# Altium project Asfaloth_L2_AVI_ver1.1.PrjPcb
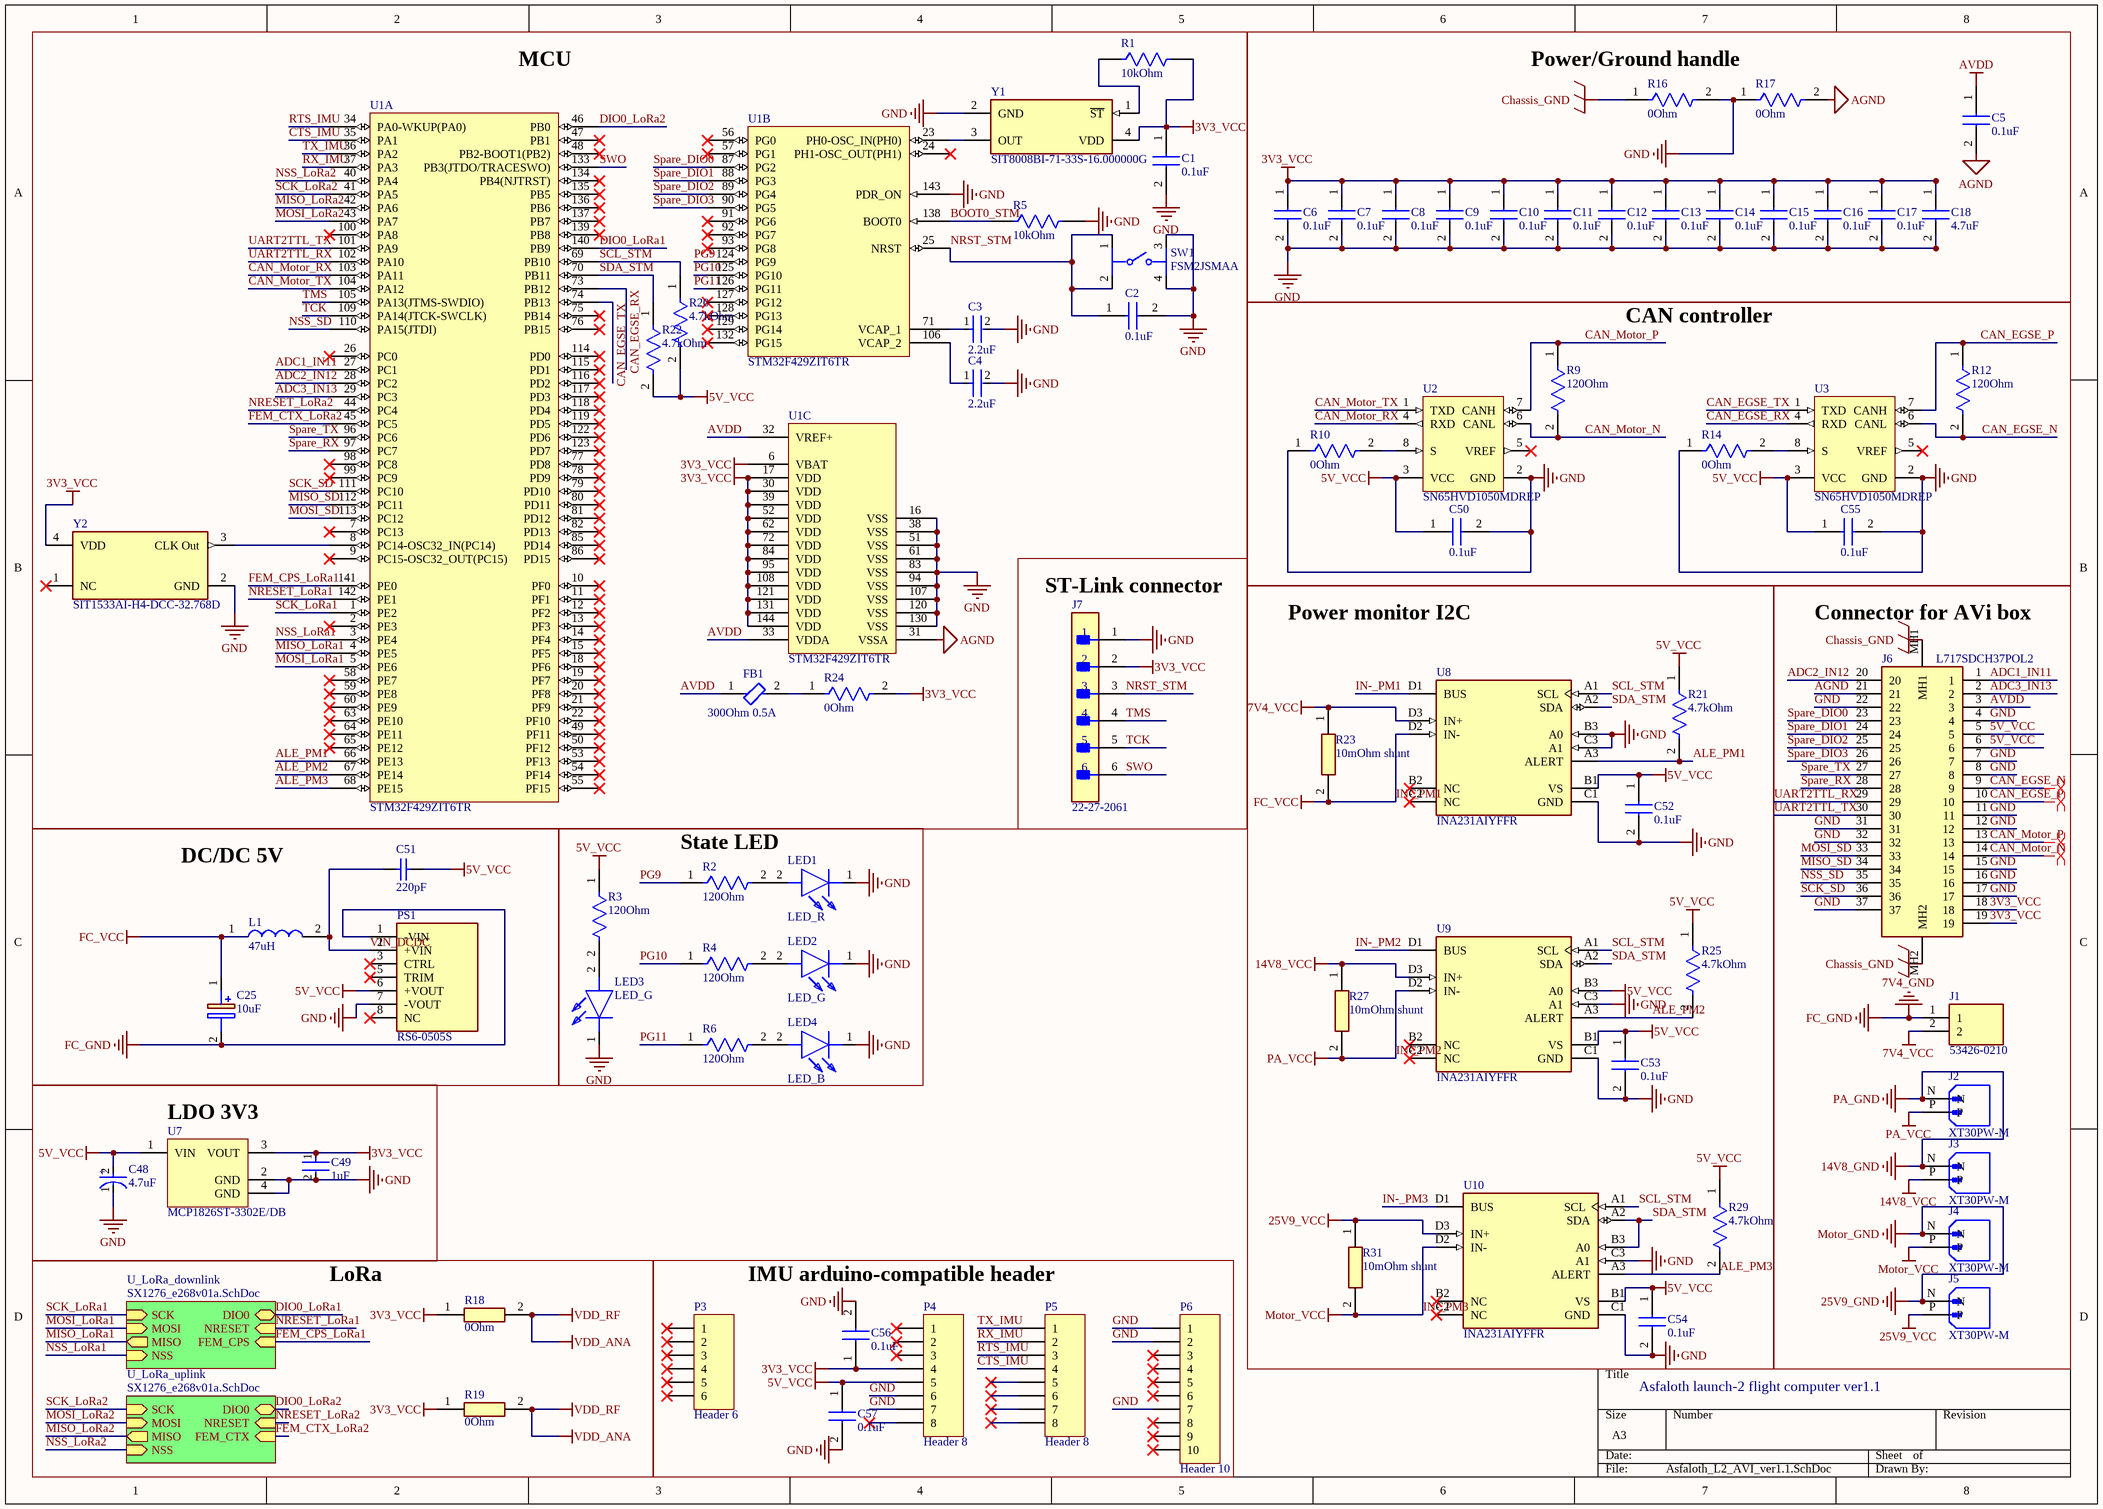
[diagram p0: Asfaloth_L2_AVI_ver1.1.SchDoc]
2 sheets, 268 parts. Net scope: hierarchical (ports join the sheet entries above them; power ports are global).
Board file: Asfaloth_L2_AVI_ver1.1.PcbDoc
Sheets:
  Asfaloth_L2_AVI_ver1.1.SchDoc
    U_LoRa_downlink = SX1276_e268v01a.SchDoc
    U_LoRa_uplink = SX1276_e268v01a.SchDoc

## Sheet Asfaloth_L2_AVI_ver1.1.SchDoc
size A3

### Parts
C1  0.1uF  [CAPC1608X87N]
C2  0.1uF  [CAPC1608X87N]
C3  2.2uF  [FP-GRT155-0_2-IPC_C]
C4  2.2uF  [FP-GRT155-0_2-IPC_C]
C5  0.1uF  [CAPC1608X87N]
C6  0.1uF  [CAPC1608X87N]
C7  0.1uF  [CAPC1608X87N]
C8  0.1uF  [CAPC1608X87N]
C9  0.1uF  [CAPC1608X87N]
C10  0.1uF  [CAPC1608X87N]
C11  0.1uF  [CAPC1608X87N]
C12  0.1uF  [CAPC1608X87N]
C13  0.1uF  [CAPC1608X87N]
C14  0.1uF  [CAPC1608X87N]
C15  0.1uF  [CAPC1608X87N]
C16  0.1uF  [CAPC1608X87N]
C17  0.1uF  [CAPC1608X87N]
C18  4.7uF  [GRT188]
C25  10uF  [CAPAE830X650N]
C48  4.7uF  [FP-TAJA-MFG]
C49  1uF  [FP-GCM21B-0_15-MFG]
C50  0.1uF  [CAPC1608X87N]
C51  220pF  [CAPC1608X87X35LL15T15]
C52  0.1uF  [CAPC1608X87N]
C53  0.1uF  [CAPC1608X87N]
C54  0.1uF  [CAPC1608X87N]
C55  0.1uF  [CAPC1608X87N]
C56  0.1uF  [CAPC1608X87N]
C57  0.1uF  [CAPC1608X87N]
FB1  300Ohm 0.5A  [FP-MMZ1608-0_8-MFG]
J1  53426-0210  [534260210]
J2  XT30PW-M  [AMASS_XT30PW-M]
J3  XT30PW-M  [AMASS_XT30PW-M]
J4  XT30PW-M  [AMASS_XT30PW-M]
J5  XT30PW-M  [AMASS_XT30PW-M]
J6  L717SDCH37POL2  [L717SDCH37POL2]
J7  22-27-2061  [FP-22-27-2061-MFG]
L1  47uH  [SRR5228A]
LED1  LED_R  [LEDC2012X80N]
LED2  LED_G  [LEDC2012X90N]
LED3  LED_G  [LEDC2012X90N]
LED4  LED_B  [LEDM2012X100N]
P3  Header 6  [HDR1X6]
P4  Header 8  [HDR1X8]
P5  Header 8  [HDR1X8]
P6  Header 10  [HDR1X10]
PS1  RS6-0505S  [RS60505S]
R1  10kOhm  [FP-CRCW0805-e3-IPC_A]
R2  120Ohm  [FP-ERJ2RK-MFG]
R3  120Ohm  [FP-ERJ2RK-MFG]
R4  120Ohm  [FP-ERJ2RK-MFG]
R5  10kOhm  [FP-CRCW0805-e3-IPC_A]
R6  120Ohm  [FP-ERJ2RK-MFG]
R9  120Ohm  [FP-ERJ2RK-MFG]
R10  0Ohm  [FP-AC0603-0_55-IPC_A]
R12  120Ohm  [FP-ERJ2RK-MFG]
R14  0Ohm  [FP-AC0603-0_55-IPC_A]
R16  0Ohm  [FP-AC0603-0_55-IPC_A]
R17  0Ohm  [FP-AC0603-0_55-IPC_A]
R18  0Ohm  [RESC3216X60N]
R19  0Ohm  [RESC3216X60N]
R20  4.7kOhm  [FP-KTR03-IPC_C]
R21  4.7kOhm  [FP-KTR03-IPC_C]
R22  4.7kOhm  [FP-KTR03-IPC_C]
R23  10mOhm shunt  [CSS0805FT10L0]
R24  0Ohm  [FP-AC0603-0_55-IPC_A]
R25  4.7kOhm  [FP-KTR03-IPC_C]
R27  10mOhm shunt  [CSS0805FT10L0]
R29  4.7kOhm  [FP-KTR03-IPC_C]
R31  10mOhm shunt  [CSS0805FT10L0]
SW1  FSM2JSMAA  [FP-FSM2JSMAA-MFG]
U1  STM32F429ZIT6TR  [STM-LQFP144_M]  (parts A,B,C of 3)
U2  SN65HVD1050MDREP  [D0008A_M]
U3  SN65HVD1050MDREP  [D0008A_M]
U7  MCP1826ST-3302E/DB  [SOT-223-DB3_L]
U8  INA231AIYFFR  [FP-YFF0012-IPC_C]
U9  INA231AIYFFR  [FP-YFF0012-IPC_C]
U10  INA231AIYFFR  [FP-YFF0012-IPC_C]
Y1  SIT8008BI-71-33S-16.000000G  [FP-SiT8008-7-MFG]
Y2  SIT1533AI-H4-DCC-32.768D  [FP-SiT1533-H-MFG]

### Blocks framed on the sheet
MCU: C1-C4 FB1 R1 R5 R20 R22 R24 SW1 U1 Y1 Y2
Power/Ground handle: C5-C18 R16 R17
CAN controller: C50 C55 R9 R10 R12 R14 U2 U3
ST-Link connector: J7
Power monitor I2C: C52-C54 R21 R23 R25 R27 R29 R31 U8-U10
Connector for AVi box: J1-J6
DC/DC 5V: C25 C51 L1 PS1
State LED: LED1-LED4 R2-R4 R6
LDO 3V3: C48 C49 U7
LoRa: R18 R19
IMU arduino-compatible header: C56 C57 P3-P6

### Sub-sheets
U_LoRa_downlink = SX1276_e268v01a.SchDoc: SCK (in), MOSI (in), MISO (out), NSS (in), DIO0 (bidir), NRESET (in), FEM_CPS (in)
U_LoRa_uplink = SX1276_e268v01a.SchDoc: SCK (in), MOSI (in), MISO (out), NSS (in), DIO0 (bidir), NRESET (in), FEM_CTX (in)

### Nets
3V3_VCC: C1.1 C6.1 C7.1 C8.1 C9.1 C10.1 C11.1 C12.1 C13.1 C14.1 C15.1 C16.1 C17.1 C18.1 C49.1 C56.1 J6.18 J6.19 J7.2 P4.4 R1.2 R18.1 R19.1 R24.2 U1.6(VBAT) U1.17(VDD) U1.30(VDD) U1.39(VDD) U1.52(VDD) U1.62(VDD) U1.72(VDD) U1.84(VDD) U1.95(VDD) U1.108(VDD) U1.121(VDD) U1.131(VDD) U1.144(VDD) U7.3(VOUT) Y1.4(VDD) Y2.4(VDD)
5V_VCC: C48.2(A) C50.1 C51.2 C52.1 C53.1 C54.1 C55.1 C57.1 J6.5 J6.6 P4.5 PS1.6(+VOUT) R3.1 R20.2 R21.1 R22.2 R25.1 R29.1 U2.3(VCC) U3.3(VCC) U7.1(VIN) U8.B1(VS) U9.B1(VS) U9.B3(A0) U10.B1(VS)
7V4_GND: C25.2(-) J1.1 PS1.1(-VIN)  [also labelled FC_GND]
7V4_VCC: J1.2 R23.1 U8.D3(IN+)
14V8_GND: J2.N J3.N  [also labelled PA_GND]
14V8_VCC: J3.P R27.1 U9.D3(IN+)
25V9_GND: J4.N J5.N  [also labelled Motor_GND]
25V9_VCC: J5.P R31.1 U10.D3(IN+)
AGND: C5.2 J6.21 R17.2 U1.31(VSSA)
AVDD: C5.1 FB1.1 J6.3 U1.32(VREF+) U1.33(VDDA)
Chassis_GND: J6.MH1 J6.MH2 R16.1
GND: C1.2 C2.2 C3.2 C4.2 C6.2 C7.2 C8.2 C9.2 C10.2 C11.2 C12.2 C13.2 C14.2 C15.2 C16.2 C17.2 C18.2 C48.1(C) C49.2 C50.2 C52.2 C53.2 C54.2 C55.2 C56.2 C57.2 J6.4 J6.7 J6.8 J6.11 J6.12 J6.15 J6.16 J6.17 J6.22 J6.31 J6.32 J6.37 J7.1 LED1.1(K) LED2.1(K) LED3.1(K) LED4.1(K) P4.6 P4.7 P6.1 P6.2 P6.7 PS1.7(-VOUT) R5.2 R10.1 R14.1 R16.2 R17.1 SW1.3 SW1.4 U1.16(VSS) U1.38(VSS) U1.51(VSS) U1.61(VSS) U1.83(VSS) U1.94(VSS) U1.107(VSS) U1.120(VSS) U1.130(VSS) U1.143(PDR_ON) U2.2(GND) U3.2(GND) U7.2(GND) U7.4(GND) U8.B3(A0) U8.C1(GND) U8.C3(A1) U9.C1(GND) U9.C3(A1) U10.C1(GND) U10.C3(A1) Y1.2(GND) Y2.2(GND)
IN-_PM1: C25.1(+) L1.1 R23.2 U8.D1(BUS) U8.D2(IN-)  [also labelled FC_VCC]
IN-_PM2: J2.P R27.2 U9.D1(BUS) U9.D2(IN-)  [also labelled PA_VCC]
IN-_PM3: J4.P R31.2 U10.D1(BUS) U10.D2(IN-)  [also labelled Motor_VCC]
VDD_ANA: R18.2 R19.2  [also labelled VDD_RF]
ADC1_IN11: J6.1 U1.27(PC1)
ADC2_IN12: J6.20 U1.28(PC2)
ADC3_IN13: J6.2 U1.29(PC3)
ALE_PM1: R21.2 U1.66(PE13) U8.A3(ALERT)
ALE_PM2: R25.2 U1.67(PE14) U9.A3(ALERT)
ALE_PM3: R29.2 U1.68(PE15) U10.A3(ALERT)
BOOT0_STM: R5.1 U1.138(BOOT0)
CAN_EGSE_N: J6.9 R12.2 U3.6(CANL)
CAN_EGSE_P: J6.10 R12.1 U3.7(CANH)
CAN_EGSE_RX: U1.73(PB12) U3.4(RXD)
CAN_EGSE_TX: U1.74(PB13) U3.1(TXD)
CAN_Motor_N: J6.14 R9.2 U2.6(CANL)
CAN_Motor_P: J6.13 R9.1 U2.7(CANH)
CAN_Motor_RX: U1.103(PA11) U2.4(RXD)
CAN_Motor_TX: U1.104(PA12) U2.1(TXD)
CTS_IMU: P5.4 U1.35(PA1)
DIO0_LoRa1: U1.140(PB9) ; sheet U_LoRa_downlink/DIO0  [project net DIO0]
DIO0_LoRa2: U1.46(PB0) ; sheet U_LoRa_uplink/DIO0  [project net DIO0]
FEM_CPS_LoRa1: U1.141(PE0) ; sheet U_LoRa_downlink/FEM_CPS  [project net FEM_CPS]
FEM_CTX_LoRa2: U1.45(PC5) ; sheet U_LoRa_uplink/FEM_CTX  [project net FEM_CTX]
MISO_LoRa1: U1.4(PE5) ; sheet U_LoRa_downlink/MISO  [project net MISO]
MISO_LoRa2: U1.42(PA6) ; sheet U_LoRa_uplink/MISO  [project net MISO]
MISO_SD: J6.34 U1.112(PC11)
MOSI_LoRa1: U1.5(PE6) ; sheet U_LoRa_downlink/MOSI  [project net MOSI]
MOSI_LoRa2: U1.43(PA7) ; sheet U_LoRa_uplink/MOSI  [project net MOSI]
MOSI_SD: J6.33 U1.113(PC12)
NRESET_LoRa1: U1.142(PE1) ; sheet U_LoRa_downlink/NRESET  [project net NRESET]
NRESET_LoRa2: U1.44(PC4) ; sheet U_LoRa_uplink/NRESET  [project net NRESET]
NRST_STM: C2.1 J7.3 SW1.1 SW1.2 U1.25(NRST)
NSS_LoRa1: U1.3(PE4) ; sheet U_LoRa_downlink/NSS  [project net NSS]
NSS_LoRa2: U1.40(PA4) ; sheet U_LoRa_uplink/NSS  [project net NSS]
NSS_SD: J6.35 U1.110(PA15(JTDI))
PG9: R2.1 U1.124(PG9)
PG10: R4.1 U1.125(PG10)
PG11: R6.1 U1.126(PG11)
RTS_IMU: P5.3 U1.34(PA0-WKUP(PA0))
RX_IMU: P5.2 U1.37(PA3)
SCK_LoRa1: U1.1(PE2) ; sheet U_LoRa_downlink/SCK  [project net SCK]
SCK_LoRa2: U1.41(PA5) ; sheet U_LoRa_uplink/SCK  [project net SCK]
SCK_SD: J6.36 U1.111(PC10)
SCL_STM: R20.1 U1.69(PB10) U8.A1(SCL) U9.A1(SCL) U10.A1(SCL)
SDA_STM: R22.1 U1.70(PB11) U8.A2(SDA) U9.A2(SDA) U10.A2(SDA) U10.B3(A0)
Spare_DIO0: J6.23 U1.87(PG2)
Spare_DIO1: J6.24 U1.88(PG3)
Spare_DIO2: J6.25 U1.89(PG4)
Spare_DIO3: J6.26 U1.90(PG5)
Spare_RX: J6.28 U1.97(PC7)
Spare_TX: J6.27 U1.96(PC6)
SWO: J7.6 U1.133(PB3(JTDO/TRACESWO))
TCK: J7.5 U1.109(PA14(JTCK-SWCLK))
TMS: J7.4 U1.105(PA13(JTMS-SWDIO))
TX_IMU: P5.1 U1.36(PA2)
UART2TTL_RX: J6.29 U1.102(PA10)
UART2TTL_TX: J6.30 U1.101(PA9)
VIN_DCDC: C51.1 L1.2 PS1.2(+VIN)
NetC3_1: C3.1 U1.71(VCAP_1)
NetC4_1: C4.1 U1.106(VCAP_2)
NetFB1_2: FB1.2 R24.1
NetLED1_2: LED1.2(A) R2.2
NetLED2_2: LED2.2(A) R4.2
NetLED3_2: LED3.2(A) R3.2
NetLED4_2: LED4.2(A) R6.2
NetR1_1: R1.1 Y1.1(~{ST})
NetR10_2: R10.2 U2.8(S)
NetR14_2: R14.2 U3.8(S)
NetU1_8: U1.8(PC14-OSC32_IN(PC14)) Y2.3(CLK_Out)
NetU1_23: U1.23(PH0-OSC_IN(PH0)) Y1.3(OUT)

Not connected (* = marked no-connect by the designer): P3 1* 2* 3* 4* 5* 6*; P4 1* 2* 3* 8*; P5 5* 6* 7* 8*; P6 3* 4* 5* 6* 8* 9* 10*; PS1 3(CTRL)* 5(TRIM)* 8(NC)*; U1 2(PE3)* 7(PC13)* 9(PC15-OSC32_OUT(PC15))* 10(PF0)* 11(PF1)* 12(PF2)* 13(PF3)* 14(PF4)* 15(PF5)* 18(PF6)* 19(PF7)* 20(PF8)* 21(PF9)* 22(PF10)* 24(PH1-OSC_OUT(PH1))* 26(PC0)* 47(PB1)* 48(PB2-BOOT1(PB2))* 49(PF11)* 50(PF12)* 53(PF13)* 54(PF14)* 55(PF15)* 56(PG0)* 57(PG1)* 58(PE7)* 59(PE8)* 60(PE9)* 63(PE10)* 64(PE11)* 65(PE12)* 75(PB14)* 76(PB15)* 77(PD8)* 78(PD9)* 79(PD10)* 80(PD11)* 81(PD12)* 82(PD13)* 85(PD14)* 86(PD15)* 91(PG6)* 92(PG7)* 93(PG8)* 98(PC8)* 99(PC9)* 100(PA8)* 114(PD0)* 115(PD1)* 116(PD2)* 117(PD3)* 118(PD4)* 119(PD5)* 122(PD6)* 123(PD7)* 127(PG12)* 128(PG13)* 129(PG14)* 132(PG15)* 134(PB4(NJTRST))* 135(PB5)* 136(PB6)* 137(PB7)* 139(PB8)*; U2 5(VREF)*; U3 5(VREF)*; U8 B2(NC)* C2(NC)*; U9 B2(NC)* C2(NC)*; U10 B2(NC)* C2(NC)*; Y2 1(NC)*

### Layout directives
differential pair: CAN_EGSE_N, CAN_EGSE_P, CAN_Motor_N, CAN_Motor_P

### Notes on the sheet
- Asfaloth launch-2 flight computer ver1.1
- (in symbol CMP-2100-03687-2) +

### Library data of the parts
C1 C2 C5-C17 C50 C52-C57 = C0603C104J4RECAUTO: Capacitor; Manufacturer_Name: KEMET; Datasheet Link: https://content.kemet.com/datasheets/KEM_C1090_X7R_ESD.pdf; Height: 0.87mm; Manufacturer_Part_Number: C0603C104J4RECAUTO; Mouser Part Number: 80-C0603C104J4RECAUT; Mouser Price/Stock: https://www.mouser.co.uk/ProductDetail/KEMET/C0603C104J4RECAUTO?qs=MLItCLRbWswpTgrKtA5UXg%3D%3D
C3 C4 = CMP-06035-008228-1: Multi-Layer Ceramic Capacitor 2.2uF 10V X6S ±10% 0402 Paper T/R; Case Code (Imperial): 0402; Max Operating Temperature: 105°C; Width: 0.02inch; Thickness: 0.022inch; Ratings: AEC-Q200; Mount: Surface Mount; Voltage Rating (DC): 10V; Capacitance: 2.2uF; Voltage Rating: 10V; Dielectric: X6S; Packaging: Tape and Reel; Case/Package: 0402; Case Code (Metric): 1005; Tolerance: 10%; Min Operating Temperature: -55°C; Length: 0.039inch
C18 = GRT188C71C475KE13D: Capacitor; Manufacturer_Name: Murata Electronics; Datasheet Link: https://www.murata.com/en-global/products/productdetail?partno=GRT188C71C475KE13%23; Height: 0.8mm; Manufacturer_Part_Number: GRT188C71C475KE13D; Mouser Part Number: 81-GRT188C71C475KE13; Mouser Price/Stock: https://www.mouser.co.uk/ProductDetail/Murata-Electronics/GRT188C71C475KE13D?qs=pUKx8fyJudC7lYX%252BQNKS7Q%3D%3D; Arrow Part Number: GRT188C71C475KE13D; Arrow Price/Stock: https://www.arrow.com/en/products/grt188c71c475ke13d/murata-manufacturing?region=nac
C25 = EEE-TG1J100P: Capacitor Polarised; Manufacturer_Name: Panasonic; Datasheet Link: http://industrial.panasonic.com/cdbs/www-data/pdf/RDE0000/ABA0000C1187.pdf; Height: 6.5mm; Manufacturer_Part_Number: EEE-TG1J100P; Mouser Part Number: 667-EEE-TG1J100P; Mouser Price/Stock: https://www.mouser.co.uk/ProductDetail/Panasonic/EEE-TG1J100P?qs=aAAGLDy8P2x3htHP%2FTxLDQ%3D%3D; Arrow Part Number: EEE-TG1J100P; Arrow Price/Stock: https://www.arrow.com/en/products/eee-tg1j100p/panasonic; Supplier 1: Mouser; Supplier Part Number 1: 667-EEE-TG1J100P
C48 = CMP-2100-03687-2: 4.7uF 16V  ±10% 4Ω 1206  SMD Tantalum Capacitor; Leakage Current: 800nA; ESR (Equivalent Series Resistance): 4R; Dissipation Factor: 6%; Polarity: Polar; Number of Pins: 2; Case Code (Metric): 3216; Dielectric Material: Tantalum; REACH SVHC: No SVHC; Height: 1.6mm; Lead Pitch: 1.1mm; Tolerance: 10%; Voltage Rating (DC): 16V; Features: General Purpose; Case Code (Imperial): 1206; Packaging: Tape and Reel; Termination: SMD/SMT; Capacitance: 4.7uF; Voltage: 16V; Case/Package: 1206; Length: 3.2mm; Max Operating Temperature: 125°C; Depth: 1.6mm; Height - Seated (Max): 0.071inch; Series: TAJ; Mount: Surface Mount; Package Quantity: 1; Radiation Hardening: No; Voltage Rating: 16V; Min Operating Temperature: -55°C; Lead Free: Lead Free; RoHS Compliant: Yes; Width: 1.6mm; Construction: Flat
C49 = CMP-06035-047787-1: Ceramic Capacitor for Automotive 1uF ±10% 16VDC X7R 0805 Embossed T/R; Voltage Rating (DC): 16V; Capacitance: 1uF; Case/Package: 0805; Dielectric: X7R; Depth: 1.25mm; Min Operating Temperature: -55°C; Max Operating Temperature: 125°C; Packaging: Tape and Reel; Length: 2mm; Tolerance: 10%
C51 = CMP-2006-03337-1: Part Number: C0603C221J5GACAUTO; Manufacturer: Kemet
FB1 = CMP-08257-000454-1: Signal Line Ferrite Bead 300Ω  @ 100MHz 500mA DCR 300mΩ SMD 0603; Impedance: 300R; Tolerance: 25%; DC Resistance (DCR): 300mR; Case Code (Metric): 1608; Core Material: Ferrite; Package Quantity: 4000; Depth: 0.8mm; RoHS Compliant: Yes; Series: MMZ; Case Code (Imperial): 0603; Mount: Surface Mount; Length: 0.063inch; Case/Package: 0603; Width: 0.031inch; Height: 0.037inch; Lead Free: Lead Free; Max DC Current: 500mA; Packaging: Tape and Reel; Current Rating: 500mA
J1 = 53426-0210: Headers & Wire Housings 2.50MM 2P RA HDR FRCTN POS LOCK; Manufacturer_Name: Molex; Geometry.Height: 6.9mm; Mouser Part Number: 538-53426-0210; Mouser Price/Stock: https://www.mouser.co.uk/ProductDetail/Molex/53426-0210?qs=9BfFgGvh7CeGd9pd%252BU8okg%3D%3D; Manufacturer_Part_Number: 53426-0210; Datasheet Link: https://www.molex.com/pdm_docs/sd/534260210_sd.pdf
J2-J5 = XT30PW-M: Socket; DC supply; XT30; male; PIN: 2; on PCBs; THT; Colour: yellow; MF: AMASS; SnapEDA_Link: https://www.snapeda.com/parts/XT30PW-M/AMASS/view-part/?ref=snap; Package: None; Value: *; MP: XT30PW-M; Check_prices: https://www.snapeda.com/parts/XT30PW-M/AMASS/view-part/?ref=eda
J6 = L717SDCH37POL2: Dsub, Stamped Signal 3A, Straight PCB Thru Hole, 37 Pin, Flash Gold, Bright Tin Shell+Grounding Dimples, 4-40 Rear Nut Height 5.9mm; Manufacturer_Name: Amphenol Communications Solutions; Geometry.Height: 12.5mm; Mouser Part Number: *; Mouser Price/Stock: *; Manufacturer_Part_Number: L717SDCH37POL2; Datasheet Link: https://cdn.amphenol-cs.com/media/wysiwyg/files/drawing/l717sdxhxxpol2.pdf
J7 = CMP-04776-000309-1: CONN HEADER VERT 6POS 2.54MM; Number of Contacts: 6; Current Rating: 4A; Voltage Rating (AC): 250V; Contact Resistance: 10mR; Hole Diameter: 1.02mm; Connector Type: Male Pin; Gender: Male; Mount: Through Hole; REACH SVHC: No SVHC; Number of Rows: 1; Contact Plating: Tin; Series: KK; Depth: 5.8mm; Flammability Rating: UL94 V-0; Contact Type: Male Pin; Lead Pitch: 2.54mm; Min Operating Temperature: 0°C; Pitch: 2.54mm; Radiation Hardening: No; Color: Natural; Length: 15.24mm; Termination: Solder; Orientation: Straight; Contact Material: Brass; Max Voltage Rating (AC): 250V; Housing Material: Nylon; Max Operating Temperature: 75°C; Working Voltage: 250V; Max Current Rating: 4A; Fastening Type: Friction; Voltage Rating: 250V; Housing Color: White; Packaging: Bulk; Material: Nylon; Contact Mating Length: 0.295inch; Package Quantity: 10000; Number of Positions: 6
L1 = SRR5228A-470M: Inductor; Manufacturer_Name: Bourns; Datasheet Link: https://www.bourns.com/docs/Product-Datasheets/SRR5228A.pdf; Manufacturer_Part_Number: SRR5228A-470M; Mouser Part Number: 6521-SRR5228A-470M; Mouser Price/Stock: https://www.mouser.co.uk/ProductDetail/Bourns/SRR5228A-470M?qs=QpmGXVUTftG9kA8o879uEQ%3D%3D; Supplier 1: Mouser; Supplier Part Number 1: 6521-SRR5228A-470M
LED1 = SML-H12V8TT86C: LED; Manufacturer_Name: ROHM Semiconductor; Datasheet Link: https://www.mouser.in/ProductDetail/ROHM-Semiconductor/SML-H12V8TT86C?qs=HXFqYaX1Q2xM3o6aiCqz5g%3D%3D; Height: 0.8mm; Manufacturer_Part_Number: SML-H12V8TT86C; Mouser Part Number: 755-SML-H12V8TT86C; Mouser Price/Stock: https://www.mouser.co.uk/ProductDetail/ROHM-Semiconductor/SML-H12V8TT86C?qs=HXFqYaX1Q2xM3o6aiCqz5g%3D%3D
LED2 LED3 = SML-H12P8TT86C: LED; Manufacturer_Name: ROHM Semiconductor; Datasheet Link: https://mouser.componentsearchengine.com/Datasheets/2/SML-H12P8TT86C.pdf; Height: 0.9mm; Manufacturer_Part_Number: SML-H12P8TT86C; Mouser Part Number: 755-SML-H12P8TT86C; Mouser Price/Stock: https://www.mouser.co.uk/ProductDetail/ROHM-Semiconductor/SML-H12P8TT86C?qs=HXFqYaX1Q2xINkpk%2F8IQZg%3D%3D
LED4 = SMLMN2BCTT86C: LED; Manufacturer_Name: ROHM Semiconductor; Datasheet Link: https://fscdn.rohm.com/en/products/databook/datasheet/opto/led/chip_mono/smlmn2bctt86(c)-e.pdf; Height: 1mm; Manufacturer_Part_Number: SMLMN2BCTT86C; Mouser Part Number: 755-SMLMN2BCTT86C; Mouser Price/Stock: https://www.mouser.co.uk/ProductDetail/ROHM-Semiconductor/SMLMN2BCTT86C?qs=EAJhGnHnT02MwYNfU4gt9w%3D%3D; Arrow Part Number: SMLMN2BCTT86C; Arrow Price/Stock: https://www.arrow.com/en/products/smlmn2bctt86c/rohm-semiconductor
P3 = Header 6: Header, 6-Pin; LatestRevisionDate: 17-Jul-2002; LatestRevisionNote: Re-released for DXP Platform.; Publisher: Altium Limited
P4 P5 = Header 8: Header, 8-Pin; LatestRevisionDate: 17-Jul-2002; LatestRevisionNote: Re-released for DXP Platform.; Publisher: Altium Limited
P6 = Header 10: Header, 10-Pin; LatestRevisionDate: 17-Jul-2002; LatestRevisionNote: Re-released for DXP Platform.; Publisher: Altium Limited
PS1 = RS6-0505S: Power Supply; Manufacturer_Name: RECOM Power; Datasheet Link: https://www.recom-power.com/pdf/Econoline/RS6.pdf; Height: 11.6mm; Manufacturer_Part_Number: RS6-0505S; Mouser Part Number: 919-RS6-0505S; Mouser Price/Stock: https://www.mouser.co.uk/ProductDetail/RECOM-Power/RS6-0505S?qs=FLBwGrBR9%252B3r5kgbzQWtZg%3D%3D; Arrow Part Number: RS6-0505S; Arrow Price/Stock: https://www.arrow.com/en/products/rs6-0505s/recom-power?region=nac; Supplier 1: Mouser; Supplier Part Number 1: 919-RS6-0505S
R1 R5 = CMP-2001-04908-2: RES Thick Film, 10kΩ, 1%, 0.125W, 100ppm/°C, 0805; Resistance: 10kR; Voltage Rating (DC): 150V; Power Rating: 125mW; Weight: 0.000194oz; Package Quantity: 5000; Military Standard: Not; Max Operating Temperature: 155°C; Temperature Coefficient: 100ppm/°C; Contact Plating: Tin; Width: 1.25mm; Height: 0.45mm; Radiation Hardening: No; Tolerance: 1%; Min Operating Temperature: -55°C; Voltage Rating: 150V; Length: 2mm; Depth: 1.25mm; Termination: SMD/SMT; Packaging: Tape and Reel; Case/Package: 0805; Case Code (Metric): 2012; Lead Free: Lead Free; Case Code (Imperial): 0805; Composition: Thick Film
R2-R4 R6 R9 R12 = CMP-2002-00645-2: RES SMD 120 OHM 1% 1/10W 0402; Resistance: 120R; Voltage Rating (DC): 50V; Temperature Coefficient: 100ppm/°C; Power Rating: 100mW; Case Code (Imperial): 0402; Military Standard: Not; Width: 0.5mm; Technology: THICK FILM; Case Code (Metric): 1005; Lead Free: Lead Free; Radiation Hardening: No; Termination: SMD/SMT; Weight: 0.000388oz; Case/Package: 0402; Resistor Type: Thick Film; Number of Pins: 2; Package Quantity: 10000; Tolerance: 1%; Depth: 0.5mm; RoHS Compliant: Yes; Min Operating Temperature: -55°C; Max Operating Temperature: 155°C; Length: 1mm; Series: ERJ-2Rx; Height: 0.35mm; Mount: Surface Mount; Number of Terminations: 2; Features: Automotive AEC-Q200; Contact Plating: Tin; Voltage Rating: 50V; Max Power Dissipation: 100mW; Packaging: Cut Tape; REACH SVHC: No SVHC
R10 R14 R16 R17 R24 = CMP-2000-04815-2: RES SMD 0 OHM JUMPER 1/10W 0603; Power Rating: 100mW; Tolerance: 1%; Voltage Rating: 50V; Resistance: 0R; Temperature Coefficient: 200ppm/°C; Min Operating Temperature: -55°C; Case Code (Imperial): 0603; Size Code: 0603; Termination: SMD/SMT; Lead Free: Lead Free; Package Quantity: 1; Max Power Dissipation: 100mW; Packaging: Tape and Reel; Series: AC; Case Code (Metric): 1608; Height: 0.022inch; Length: 0.063inch; Case/Package: 0603; Resistor Type: Thick Film; Max Operating Temperature: 155°C; Features: Moisture Resistant; Width: 0.031inch; Number of Terminations: 2
R18 R19 = RCA12060000ZSEA: Resistor; Manufacturer_Name: Vishay; Datasheet Link: https://www.mouser.in/datasheet/2/427/rcae3-1761931.pdf; Height: 0.6mm; Manufacturer_Part_Number: RCA12060000ZSEA; Mouser Part Number: 71-RCA12060000ZSEA; Mouser Price/Stock: https://www.mouser.co.uk/ProductDetail/Vishay-Draloric/RCA12060000ZSEA?qs=4%252Ber4tcBTOgzMfDdqtZgmA%3D%3D; Arrow Part Number: RCA12060000ZSEA; Arrow Price/Stock: https://www.arrow.com/en/products/rca12060000zsea/vishay?region=nac
R20-R22 R25 R29 = CMP-08839-030274-1: Res Thick Film 0603 4.7kΩ 5% 0.1W ±200ppm/°C Automotive Paper T/R; Max Power Dissipation: 100mW; Resistance: 4.7kR; Width: 0.031inch; Series: KTR03; Number of Terminations: 2; RoHS Compliant: Yes; Package Quantity: 5000; Min Operating Temperature: -55°C; Height: 0.022inch; Length: 0.063inch; Resistor Type: Thick Film; Tolerance: 5%; Case/Package: 0603; Temperature Coefficient: 200ppm/°C; Max Operating Temperature: 155°C; Packaging: Tape and Reel
R23 R27 R31 = CSS0805FT10L0: Resistor; Manufacturer_Name: Stackpole Electronics; Datasheet Link: https://cs.seielect.com/catalog/SEI-CSS_CSSH.PDF; Height: 0.65mm; Manufacturer_Part_Number: CSS0805FT10L0; Mouser Part Number: 708-CSS0805FT10L0; Mouser Price/Stock: https://www.mouser.co.uk/ProductDetail/SEI-Stackpole/CSS0805FT10L0?qs=IPgv5n7u5QYApC%252BwHqTVbQ%3D%3D
SW1 = CMP-03402-000003-1: SWITCH TACTILE SPST-NO 0.05A 24V; Manufacturer: TE Connectivity; Standoff Height: 0.05mm; Contact Current Rating: 50mA; Electromechanical Life: 100000Cycles; Operating Force: 260gf; Contact Resistance: 100mΩ; Package: 0; Temperature Range High: +85°C; Temperature: -35°C to +85°C; Category: Switch; Manufacturer Part Number: FSM2JSMAA; RoHS: TRUE; Mouser Description: Tactile Switches TACTILE 260G FORCE S; Device Class L1: Electromechanical; Mount: Surface Mount; Height: 4.59mm; ComponentLink2URL: https://www.te.com/commerce/DocumentDelivery/DDEController?Action=showdoc&DocId=Customer+Drawing%7F2-1437565-7%7FV%7Fpdf%7FEnglish%7FENG_CD_2-1437565-7_V.pdf%7F2-1437565-8; Temperature Range Low: -35°C; Voltage Rating Dc: 24V; Lead Free: Yes; Automotive: No; Throw Configuration: SPST-NO; Octopart: https://octopart.com/fsm2jsmaa-te+connectivity-41720620; Device Class L2: Switches; Device Class L3: Pushbutton Switches; ComponentLink2Description: Datasheet; Digikey Description: SWITCH TACTILE SPST-NO 0.05A 24V
U1 = CMP-0243-00201-1: ARM Cortex-M4 32-bit MCU+FPU, 2048 KB Flash, 256 KB Internal RAM, 114 I/Os, 144-Pin LQFP, -40 to 85 degC, Tape and Reel; FLASH Size (Prog) (kB): 2048; D/A Converter: 2; I/Os (High Current): 114; Internal RAM Size (kB): 256; Supply Voltage(Vcc) min (V): 1.7; Operating Frequency(F) (Processor speed) (MHz): 180; ComponentLink2URL: http://www.st.com/st-web-ui/static/active/en/resource/technical/document/datasheet/DM00071990.pdf; Package Reference: 144-Pin Low Profile Quad Flat Package, Body 20 x 20 mm, Pitch 0.5 mm; ComponentLink2Description: Datasheet; Mounting Technology: Surface Mount; DatasheetVersion: Rev. 7; ComponentLink1URL: http://www.st.com/; Package Description: LQFP144; ComponentLink1Description: Manufacturer URL; Packing: Tape and Reel; Core: ARM Cortex-M4
U2 U3 = CMP-0315-00066-2: Enhanced Product Emc Optimized Can Transceiver, 70 mA, -55 to 125 degC, 8-pin SOIC (D), Green (RoHS & no Sb/Br); Manufacturer: Texas Instruments; Rating: HiRel Enhanced Product; Receivers Per Package: 1; ICC(Max)(mA): 10, 70, 10; ComponentLink1URL: http://www.ti.com/general/docs/lit/getliterature.tsp?genericPartNumber=SN65HVD1050-EP&fileType=pdf; ComponentLink1Description: Datasheet; PartNumber: SN65HVD1050MDREP; PackageDescription: 8-Pin Plastic Small Outline Integrated Circuit, 4.9 x 3.9 mm, Pitch 1.27 mm Pitch; Drivers Per Package: 1; Isolated: No; Eco-Plan: Green (RoHS & no Sb/Br); PackageVersion: revM, Jun-2011; Code_JEDEC: MS-012AA; Mounting Technology: Surface Mount; PackageReference: D0008A; DatasheetVersion: SLLS772A; SubFamily: CAN
U7 = CMP-0136-00497-1: 1000 mA, Low Voltage, Low Quiescent Current LDO Regulator, 3-Pin SOT-223, Extended Temperature, Tape and Reel; PackageVersion: revBB, Aug-2009; PackageDescription: 3-Lead Plastic Small Outline Transistor (DB) [SOT-223]; DatasheetVersion: revA, Aug-2007; PackageReference: SOT-223-DB3
U8-U10 = CMP-04910-000108-1: IC CURRENT MONITOR 100DB 12DSBGA; Min Supply Voltage: 2.7V; Accuracy: 0.5%; Nominal Supply Current: 330uA; Max Supply Voltage: 5.5V; Lead Free: Lead Free; Number of Pins: 12; Max Operating Temperature: 125°C; Min Operating Temperature: -40°C; Packaging: Tape and Reel; Radiation Hardening: No; RoHS Compliant: Yes; Mount: Surface Mount; Package Quantity: 3000
Y1 = CMP-25159-264800-1: MEMS OSC XO 16.0000MHZ H/LV-CMOS; Frequency Stability: 20ppm; Max Supply Current: 4.5mA; Frequency: 16MHz; Series: SIT8008B; Mount: Surface Mount; Packaging: Cut Tape; Case/Package: SMD/SMT; Min Operating Temperature: -40°C; Max Operating Temperature: 85°C; RoHS Compliant: Yes
Y2 = CMP-25159-260514-1: MEMS OSC XO 32.7680KHZ LVCMOS; Frequency Stability: 100ppm; Max Supply Current: 1.4uA; Frequency: 32.768kHz; Max Operating Temperature: 85°C; Min Operating Temperature: -40°C; Mount: Surface Mount; Series: SiT1533; Packaging: Cut Tape; RoHS Compliant: Yes; Case/Package: SMD/SMT

## Sheet SX1276_e268v01a.SchDoc
size A3
Used 2 times, as channels U_LoRa_downlink, U_LoRa_uplink. Parts and nets are listed once, with the designators drawn on the sheet.
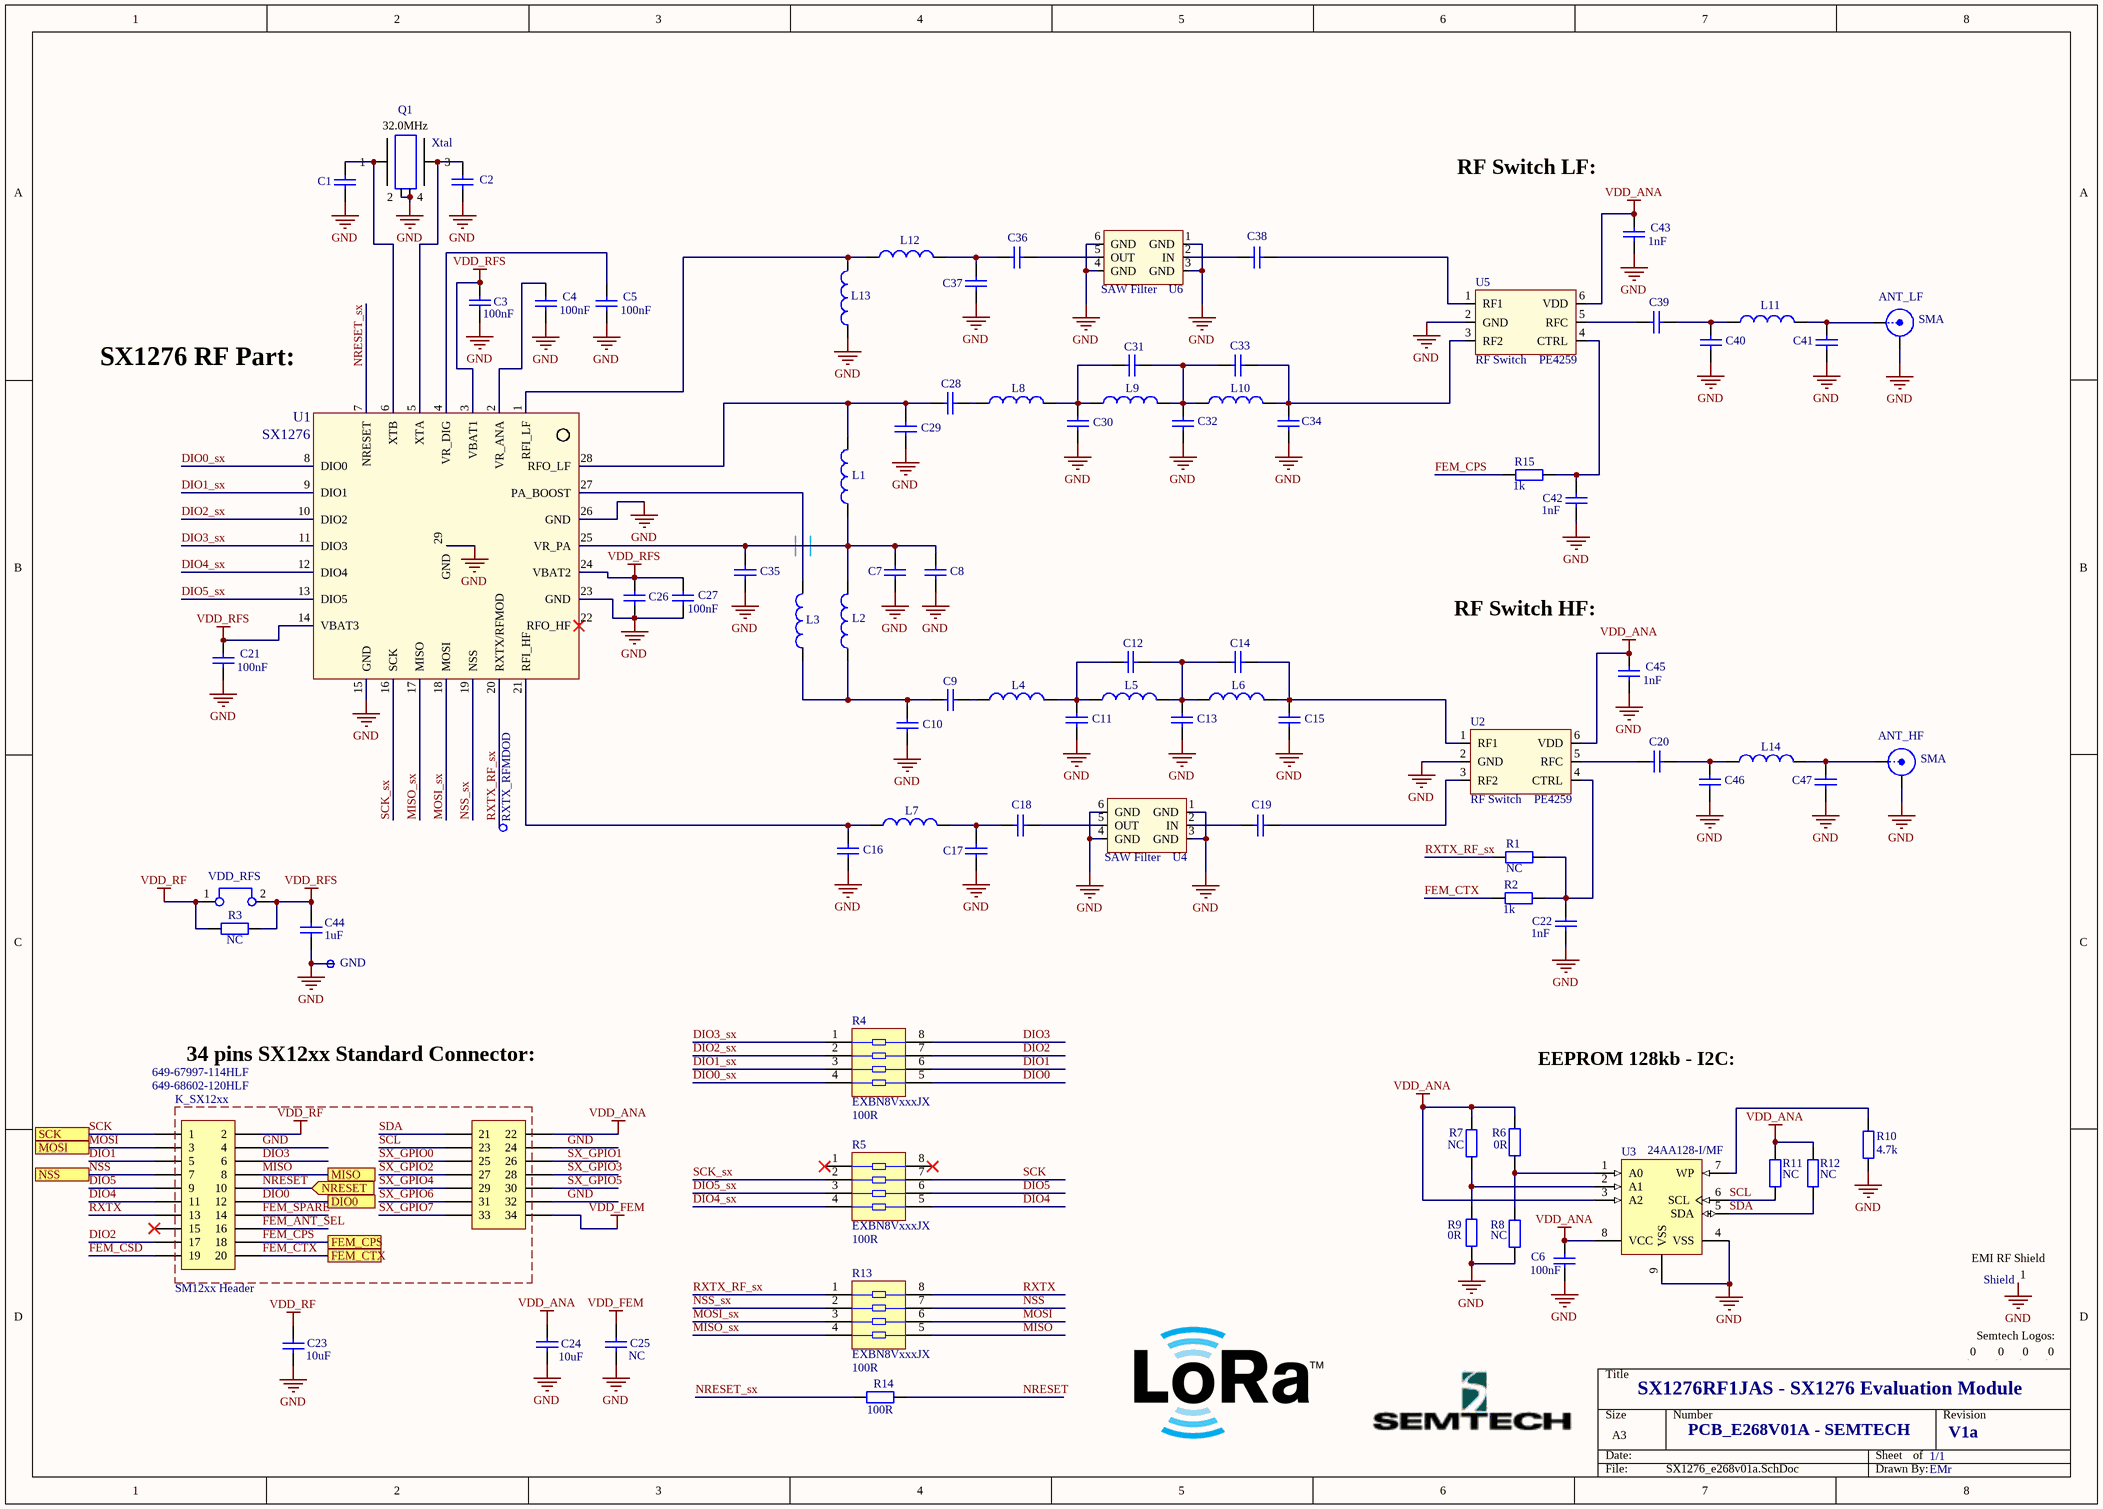
[diagram p1: SX1276_e268v01a.SchDoc]

### Parts
ANT_HF  SMA  [SMA END LAUNCH JACK RECEPTACLE SHORT]
ANT_LF  SMA  [SMA END LAUNCH JACK RECEPTACLE SHORT]
C1  Cap  [rlc_402_smd]  (value not drawn)
C2  Cap  [rlc_402_smd]  (value not drawn)
C3  value 100nF  [rlc_402_smd]  (hidden comment: Cap)
C4  value 100nF  [rlc_402_smd]  (hidden comment: Cap)
C5  value 100nF  [rlc_402_smd]  (hidden comment: Cap)
C6  value 100nF  [rlc_402_smd]  (hidden comment: Cap)
C7  Cap  [rlc_402_smd]  (value not drawn)
C8  Cap  [rlc_402_smd]  (value not drawn)
C9  Cap  [rlc_402_smd]  (value not drawn)
C10  Cap  [rlc_402_smd]  (value not drawn)
C11  Cap  [rlc_402_smd]  (value not drawn)
C12  Cap  [rlc_402_smd]  (value not drawn)
C13  Cap  [rlc_402_smd]  (value not drawn)
C14  Cap  [rlc_402_smd]  (value not drawn)
C15  Cap  [rlc_402_smd]  (value not drawn)
C16  Cap  [rlc_402_smd]  (value not drawn)
C17  Cap  [rlc_402_smd]  (value not drawn)
C18  Cap  [rlc_402_smd]  (value not drawn)
C19  Cap  [rlc_402_smd]  (value not drawn)
C20  Cap  [rlc_402_smd]  (value not drawn)
C21  value 100nF  [rlc_402_smd]  (hidden comment: Cap)
C22  value 1nF  [rlc_402_smd]  (hidden comment: Cap)
C23  value 10uF  [rlc_805_smd]  (hidden comment: Cap)
C24  value 10uF  [rlc_805_smd]  (hidden comment: Cap)
C25  value NC  [rlc_805_smd]  (hidden comment: Cap)
C26  Cap  [rlc_402_smd]  (value not drawn)
C27  value 100nF  [rlc_402_smd]  (hidden comment: Cap)
C28  Cap  [rlc_402_smd]  (value not drawn)
C29  Cap  [rlc_402_smd]  (value not drawn)
C30  Cap  [rlc_402_smd]  (value not drawn)
C31  Cap  [rlc_402_smd]  (value not drawn)
C32  Cap  [rlc_402_smd]  (value not drawn)
C33  Cap  [rlc_402_smd]  (value not drawn)
C34  Cap  [rlc_402_smd]  (value not drawn)
C35  Cap  [rlc_402_smd]  (value not drawn)
C36  Cap  [rlc_402_smd]  (value not drawn)
C37  Cap  [rlc_402_smd]  (value not drawn)
C38  Cap  [rlc_402_smd]  (value not drawn)
C39  Cap  [rlc_402_smd]  (value not drawn)
C40  Cap  [rlc_402_smd]  (value not drawn)
C41  Cap  [rlc_402_smd]  (value not drawn)
C42  value 1nF  [rlc_402_smd]  (hidden comment: Cap)
C43  value 1nF  [rlc_402_smd]  (hidden comment: Cap)
C44  value 1uF  [rlc_603_smd]  (hidden comment: Cap Semi)
C45  value 1nF  [rlc_402_smd]  (hidden comment: Cap)
C46  Cap  [rlc_402_smd]  (value not drawn)
C47  Cap  [rlc_402_smd]  (value not drawn)
GND  Test Pin  [pin_1mm]  (value not drawn)
K_SX12xx  SM12xx Header  Supplier Part Number 1: 649-68602-120HLF  Supplier Part Number 2: 649-67997-114HLF  [HDR34 Header]
L1  Inductor  [rlc_402_smd]  (value not drawn)
L2  Inductor  [rlc_402_smd]  (value not drawn)
L3  Inductor  [rlc_402_smd]  (value not drawn)
L4  Inductor  [rlc_402_smd]  (value not drawn)
L5  Inductor  [rlc_402_smd]  (value not drawn)
L6  Inductor  [rlc_402_smd]  (value not drawn)
L7  Inductor  [rlc_402_smd]  (value not drawn)
L8  Inductor  [rlc_402_smd]  (value not drawn)
L9  Inductor  [rlc_402_smd]  (value not drawn)
L10  Inductor  [rlc_402_smd]  (value not drawn)
L11  Inductor  [rlc_402_smd]  (value not drawn)
L12  Inductor  [rlc_402_smd]  (value not drawn)
L13  Inductor  [rlc_402_smd]  (value not drawn)
L14  Inductor  [rlc_402_smd]  (value not drawn)
Logo_Bot  Logo symbol  [logo_semtech_horiz_size3]  (value not drawn)
Logo_Lora_Bot  Logo symbol  [Logo LoRa Size4]  (value not drawn)
Logo_Lora_Top  Logo symbol  [Logo LoRa Size3]  (value not drawn)
Logo_Top  Logo symbol  [logo_semtech_horiz_size2]  (value not drawn)
Q1  Xtal  value 32.0MHz  [nd3225da - nd2520da]
R1  value NC  [rlc_402_smd]  (hidden comment: Resistor)
R2  value 1k  [rlc_402_smd]  (hidden comment: Resistor)
R3  value NC  [rlc_805_smd]  (hidden comment: Resistor)
R4  EXBN8VxxxJX  value 100R  [EXB28V]
R5  EXBN8VxxxJX  value 100R  [EXB28V]
R6  value 0R  [rlc_402_smd]  (hidden comment: Resistor)
R7  value NC  [rlc_402_smd]  (hidden comment: Resistor)
R8  value NC  [rlc_402_smd]  (hidden comment: Resistor)
R9  value 0R  [rlc_402_smd]  (hidden comment: Resistor)
R10  value 4.7k  [rlc_402_smd]  (hidden comment: Resistor)
R11  value NC  [rlc_402_smd]  (hidden comment: Resistor)
R12  value NC  [rlc_402_smd]  (hidden comment: Resistor)
R13  EXBN8VxxxJX  value 100R  [EXB28V]
R14  value 100R  [rlc_402_smd]  (hidden comment: Resistor)
R15  value 1k  [rlc_402_smd]  (hidden comment: Resistor)
RXTX_RFMDOD  Test Pin  [pin_SMD]  (value not drawn)
Shield  Logo symbol  [BMIS-205-F - Shield]  (value not drawn)
U1  SX1276  [vqfn28_6x6mm]
U2  RF Switch  value PE4259  [SC70-6]
U3  24AA128-I/MF  [DFN8_ 5x6mm]
U4  SAW Filter  [DCC6C_3.0x3.0mm]
U5  RF Switch  value PE4259  [SC70-6]
U6  SAW Filter  [DCC6C_3.0x3.0mm]
VDD_RFS  Jumper  [bridge_254mm]  (value not drawn)

### Ports
DIO0, FEM_CPS, FEM_CTX, MISO, MOSI, NRESET (in), NSS, SCK

### Nets
GND: ANT_HF.2(GND) ANT_LF.2(GND) C1.1 C2.1 C3.1 C4.1 C5.1 C6.1 C7.1 C8.1 C10.1 C11.1 C13.1 C15.1 C16.1 C17.1 C21.1 C22.2 C23.1 C24.1 C25.2 C26.1 C27.1 C29.1 C30.1 C32.1 C34.1 C35.1 C37.1 C40.1 C41.1 C42.2 C43.1 C44.1 C45.1 C46.1 C47.1 GND.1(pin) K_SX12xx.4 K_SX12xx.24 K_SX12xx.32 L13.1 Q1.2 Q1.4 R8.1 R9.1 R10.1 Shield.1 U1.15(GND) U1.23(GND) U1.26(GND) U1.29(GND) U2.2(GND) U3.4(VSS) U3.9(VSS) U4.1(GND) U4.3(GND) U4.4(GND) U4.6(GND) U5.2(GND) U6.1(GND) U6.3(GND) U6.4(GND) U6.6(GND)
VDD_ANA: C6.2 C24.2 C43.2 C45.2 K_SX12xx.22 R6.2 R7.2 R11.2 R12.2 U2.6(VDD) U3.3(A2) U3.8(VCC) U5.6(VDD)
VDD_FEM: C25.1 K_SX12xx.34
VDD_RF: C23.2 K_SX12xx.2 R3.2 VDD_RFS.1
VDD_RFS: C3.2 C21.2 C26.2 C27.2 C44.2 R3.1 U1.3(VBAT1) U1.14(VBAT3) U1.24(VBAT2) VDD_RFS.2
DIO0: K_SX12xx.12 R4.5 ; port DIO0
DIO0_sx: R4.4 U1.8(DIO0)
DIO1: K_SX12xx.5 R4.6
DIO1_sx: R4.3 U1.9(DIO1)
DIO2: K_SX12xx.17 R4.7
DIO2_sx: R4.2 U1.10(DIO2)
DIO3: K_SX12xx.6 R4.8
DIO3_sx: R4.1 U1.11(DIO3)
DIO4: K_SX12xx.11 R5.5
DIO4_sx: R5.4 U1.12(DIO4)
DIO5: K_SX12xx.9 R5.6
DIO5_sx: R5.3 U1.13(DIO5)
FEM_ANT_SEL: K_SX12xx.16
FEM_CPS: K_SX12xx.18 R15.2 ; port FEM_CPS
FEM_CSD: K_SX12xx.19
FEM_CTX: K_SX12xx.20 R2.2 ; port FEM_CTX
FEM_SPARE: K_SX12xx.14
MISO: K_SX12xx.8 R13.5 ; port MISO
MISO_sx: R13.4 U1.17(MISO)
MOSI: K_SX12xx.3 R13.6 ; port MOSI
MOSI_sx: R13.3 U1.18(MOSI)
NRESET: K_SX12xx.10 R14.2 ; port NRESET
NRESET_sx: R14.1 U1.7(NRESET)
NSS: K_SX12xx.7 R13.7 ; port NSS
NSS_sx: R13.2 U1.19(NSS)
RXTX: K_SX12xx.13 R13.8
RXTX_RF_sx: R1.1 R13.1 RXTX_RFMDOD.1(pin) U1.20(RXTX/RFMOD)
SCK: K_SX12xx.1 R5.7 ; port SCK
SCK_sx: R5.2 U1.16(SCK)
SCL: K_SX12xx.23 R11.1 U3.6(SCL)
SDA: K_SX12xx.21 R12.1 U3.5(SDA)
SX_GPIO0: K_SX12xx.25
SX_GPIO1: K_SX12xx.26
SX_GPIO2: K_SX12xx.27
SX_GPIO3: K_SX12xx.28
SX_GPIO4: K_SX12xx.29
SX_GPIO5: K_SX12xx.30
SX_GPIO6: K_SX12xx.31
SX_GPIO7: K_SX12xx.33
NetANT_HF_1: ANT_HF.1(Signal) C47.2 L14.2
NetANT_LF_1: ANT_LF.1(Signal) C41.2 L11.2
NetC1_2: C1.2 Q1.1 U1.6(XTB)
NetC2_2: C2.2 Q1.3 U1.5(XTA)
NetC4_2: C4.2 U1.2(VR_ANA)
NetC5_2: C5.2 U1.4(VR_DIG)
NetC7_2: C7.2 C8.2 C35.2 L1.1 L2.2 U1.25(VR_PA)
NetC9_1: C9.1 L4.1
NetC9_2: C9.2 C10.2 L2.1 L3.1
NetC11_2: C11.2 C12.2 L4.2 L5.1
NetC12_1: C12.1 C13.2 C14.2 L5.2 L6.1
NetC14_1: C14.1 C15.2 L6.2 U2.1(RF1)
NetC16_2: C16.2 L7.1 U1.21(RFI_HF)
NetC17_2: C17.2 C18.2 L7.2
NetC18_1: C18.1 U4.5(OUT)
NetC19_1: C19.1 U2.3(RF2)
NetC19_2: C19.2 U4.2(IN)
NetC20_1: C20.1 C46.2 L14.1
NetC20_2: C20.2 U2.5(RFC)
NetC22_1: C22.1 R1.2 R2.1 U2.4(CTRL)
NetC28_1: C28.1 L8.1
NetC28_2: C28.2 C29.2 L1.2 U1.28(RFO_LF)
NetC30_2: C30.2 C31.2 L8.2 L9.1
NetC31_1: C31.1 C32.2 C33.2 L9.2 L10.1
NetC33_1: C33.1 C34.2 L10.2 U5.3(RF2)
NetC36_1: C36.1 U6.5(OUT)
NetC36_2: C36.2 C37.2 L12.2
NetC38_1: C38.1 U5.1(RF1)
NetC38_2: C38.2 U6.2(IN)
NetC39_1: C39.1 C40.2 L11.1
NetC39_2: C39.2 U5.5(RFC)
NetC42_1: C42.1 R15.1 U5.4(CTRL)
NetL3_2: L3.2 U1.27(PA_BOOST)
NetL12_1: L12.1 L13.2 U1.1(RFI_LF)
NetR6_1: R6.1 R8.2 U3.1(A0)
NetR7_1: R7.1 R9.2 U3.2(A1)
NetR10_2: R10.2 U3.7(WP)

Not connected (* = marked no-connect by the designer): K_SX12xx 15*; Logo_Bot 0; Logo_Lora_Bot 0; Logo_Lora_Top 0; Logo_Top 0; R5 1* 8*; U1 22(RFO_HF)*

### Channels
U_LoRa_downlink: designators ANT_HF=ANT_HF_U_LoRa_downlink ANT_LF=ANT_LF_U_LoRa_downlink C1=C1_U_LoRa_downlink C2=C2_U_LoRa_downlink C3=C3_U_LoRa_downlink C4=C4_U_LoRa_downlink C5=C5_U_LoRa_downlink C6=C6_U_LoRa_downlink C7=C7_U_LoRa_downlink C8=C8_U_LoRa_downlink C9=C9_U_LoRa_downlink C10=C10_U_LoRa_downlink C11=C11_U_LoRa_downlink C12=C12_U_LoRa_downlink C13=C13_U_LoRa_downlink C14=C14_U_LoRa_downlink C15=C15_U_LoRa_downlink C16=C16_U_LoRa_downlink C17=C17_U_LoRa_downlink C18=C18_U_LoRa_downlink C19=C19_U_LoRa_downlink C20=C20_U_LoRa_downlink C21=C21_U_LoRa_downlink C22=C22_U_LoRa_downlink C23=C23_U_LoRa_downlink C24=C24_U_LoRa_downlink C25=C25_U_LoRa_downlink C26=C26_U_LoRa_downlink C27=C27_U_LoRa_downlink C28=C28_U_LoRa_downlink C29=C29_U_LoRa_downlink C30=C30_U_LoRa_downlink C31=C31_U_LoRa_downlink C32=C32_U_LoRa_downlink C33=C33_U_LoRa_downlink C34=C34_U_LoRa_downlink C35=C35_U_LoRa_downlink C36=C36_U_LoRa_downlink C37=C37_U_LoRa_downlink C38=C38_U_LoRa_downlink C39=C39_U_LoRa_downlink C40=C40_U_LoRa_downlink C41=C41_U_LoRa_downlink C42=C42_U_LoRa_downlink C43=C43_U_LoRa_downlink C44=C44_U_LoRa_downlink C45=C45_U_LoRa_downlink C46=C46_U_LoRa_downlink C47=C47_U_LoRa_downlink GND=GND_U_LoRa_downlink K_SX12xx=LoRa_downlink L1=L1_U_LoRa_downlink L2=L2_U_LoRa_downlink L3=L3_U_LoRa_downlink L4=L4_U_LoRa_downlink L5=L5_U_LoRa_downlink L6=L6_U_LoRa_downlink L7=L7_U_LoRa_downlink L8=L8_U_LoRa_downlink L9=L9_U_LoRa_downlink L10=L10_U_LoRa_downlink L11=L11_U_LoRa_downlink L12=L12_U_LoRa_downlink L13=L13_U_LoRa_downlink L14=L14_U_LoRa_downlink Logo Bot=Logo_Bot_U_LoRa_downlink Logo Lora Bot=Logo_Lora_Bot_U_LoRa_downlink Logo Lora Top=Logo_Lora_Top_U_LoRa_downlink Logo Top=Logo_Top_U_LoRa_downlink Q1=Q1_U_LoRa_downlink R1=R1_U_LoRa_downlink R2=R2_U_LoRa_downlink R3=R3_U_LoRa_downlink R4=R4_U_LoRa_downlink R5=R5_U_LoRa_downlink R6=R6_U_LoRa_downlink R7=R7_U_LoRa_downlink R8=R8_U_LoRa_downlink R9=R9_U_LoRa_downlink R10=R10_U_LoRa_downlink R11=R11_U_LoRa_downlink R12=R12_U_LoRa_downlink R13=R13_U_LoRa_downlink R14=R14_U_LoRa_downlink R15=R15_U_LoRa_downlink RXTX_RFMDOD=RXTX_RFMDOD_U_LoRa_downlink Shield=Shield_U_LoRa_downlink U1=U1_U_LoRa_downlink U2=U2_U_LoRa_downlink U3=U3_U_LoRa_downlink U4=U4_U_LoRa_downlink U5=U5_U_LoRa_downlink U6=U6_U_LoRa_downlink VDD_RFS=VDD_RFS_U_LoRa_downlink; ports DIO0=DIO0 FEM_CPS=FEM_CPS FEM_CTX=FEM_CTX_U_LoRa_downlink MISO=MISO MOSI=MOSI NRESET=NRESET NSS=NSS SCK=SCK
U_LoRa_uplink: designators ANT_HF=ANT_HF_U_LoRa_uplink ANT_LF=ANT_LF_U_LoRa_uplink C1=C1_U_LoRa_uplink C2=C2_U_LoRa_uplink C3=C3_U_LoRa_uplink C4=C4_U_LoRa_uplink C5=C5_U_LoRa_uplink C6=C6_U_LoRa_uplink C7=C7_U_LoRa_uplink C8=C8_U_LoRa_uplink C9=C9_U_LoRa_uplink C10=C10_U_LoRa_uplink C11=C11_U_LoRa_uplink C12=C12_U_LoRa_uplink C13=C13_U_LoRa_uplink C14=C14_U_LoRa_uplink C15=C15_U_LoRa_uplink C16=C16_U_LoRa_uplink C17=C17_U_LoRa_uplink C18=C18_U_LoRa_uplink C19=C19_U_LoRa_uplink C20=C20_U_LoRa_uplink C21=C21_U_LoRa_uplink C22=C22_U_LoRa_uplink C23=C23_U_LoRa_uplink C24=C24_U_LoRa_uplink C25=C25_U_LoRa_uplink C26=C26_U_LoRa_uplink C27=C27_U_LoRa_uplink C28=C28_U_LoRa_uplink C29=C29_U_LoRa_uplink C30=C30_U_LoRa_uplink C31=C31_U_LoRa_uplink C32=C32_U_LoRa_uplink C33=C33_U_LoRa_uplink C34=C34_U_LoRa_uplink C35=C35_U_LoRa_uplink C36=C36_U_LoRa_uplink C37=C37_U_LoRa_uplink C38=C38_U_LoRa_uplink C39=C39_U_LoRa_uplink C40=C40_U_LoRa_uplink C41=C41_U_LoRa_uplink C42=C42_U_LoRa_uplink C43=C43_U_LoRa_uplink C44=C44_U_LoRa_uplink C45=C45_U_LoRa_uplink C46=C46_U_LoRa_uplink C47=C47_U_LoRa_uplink GND=GND_U_LoRa_uplink K_SX12xx=LoRa_uplink L1=L1_U_LoRa_uplink L2=L2_U_LoRa_uplink L3=L3_U_LoRa_uplink L4=L4_U_LoRa_uplink L5=L5_U_LoRa_uplink L6=L6_U_LoRa_uplink L7=L7_U_LoRa_uplink L8=L8_U_LoRa_uplink L9=L9_U_LoRa_uplink L10=L10_U_LoRa_uplink L11=L11_U_LoRa_uplink L12=L12_U_LoRa_uplink L13=L13_U_LoRa_uplink L14=L14_U_LoRa_uplink Logo Bot=Logo_Bot_U_LoRa_uplink Logo Lora Bot=Logo_Lora_Bot_U_LoRa_uplink Logo Lora Top=Logo_Lora_Top_U_LoRa_uplink Logo Top=Logo_Top_U_LoRa_uplink Q1=Q1_U_LoRa_uplink R1=R1_U_LoRa_uplink R2=R2_U_LoRa_uplink R3=R3_U_LoRa_uplink R4=R4_U_LoRa_uplink R5=R5_U_LoRa_uplink R6=R6_U_LoRa_uplink R7=R7_U_LoRa_uplink R8=R8_U_LoRa_uplink R9=R9_U_LoRa_uplink R10=R10_U_LoRa_uplink R11=R11_U_LoRa_uplink R12=R12_U_LoRa_uplink R13=R13_U_LoRa_uplink R14=R14_U_LoRa_uplink R15=R15_U_LoRa_uplink RXTX_RFMDOD=RXTX_RFMDOD_U_LoRa_uplink Shield=Shield_U_LoRa_uplink U1=U1_U_LoRa_uplink U2=U2_U_LoRa_uplink U3=U3_U_LoRa_uplink U4=U4_U_LoRa_uplink U5=U5_U_LoRa_uplink U6=U6_U_LoRa_uplink VDD_RFS=VDD_RFS_U_LoRa_uplink; ports DIO0=DIO0 FEM_CPS=FEM_CPS_U_LoRa_uplink FEM_CTX=FEM_CTX MISO=MISO MOSI=MOSI NRESET=NRESET NSS=NSS SCK=SCK

### Notes on the sheet
- RF Switch LF:
- (near U1) SX1276 RF Part:
- RF Switch HF:
- 34 pins SX12xx Standard Connector:
- EEPROM 128kb - I2C:
- (near Shield) EMI RF Shield
- SX1276RF1JAS - SX1276 Evaluation Module
- Semtech Logos:
- PCB_E268V01A - SEMTECH
- 1/1
- V1a
- EMr

### Library data of the parts
ANT_HF ANT_LF = SMA: SMA Straight Connector; LatestRevisionDate: 05-oct-2007  -  Semtech; LatestRevisionNote: Re-released for DXP Platform.; Publisher: Altium Limited
C1 = Cap: Capacitor SMD; Value: 18pnF; Published: 8-Jun-2000; LatestRevisionDate: 05-oct-2007  -  Semtech; LatestRevisionNote: Re-released for DXP Platform.; Publisher: Altium Limited
C2 = Cap: Capacitor SMD; Value: 18pF; Published: 8-Jun-2000; LatestRevisionDate: 05-oct-2007  -  Semtech; LatestRevisionNote: Re-released for DXP Platform.; Publisher: Altium Limited
C3-C6 C21-C25 C27 C42 C43 C45 = Cap: Capacitor SMD; Published: 8-Jun-2000; LatestRevisionDate: 05-oct-2007  -  Semtech; LatestRevisionNote: Re-released for DXP Platform.; Publisher: Altium Limited
C7-C20 C28-C33 C35-C39 = Cap: Capacitor SMD; Value: 100nF; Published: 8-Jun-2000; LatestRevisionDate: 05-oct-2007  -  Semtech; LatestRevisionNote: Re-released for DXP Platform.; Publisher: Altium Limited
C26 = Cap: Capacitor SMD; Value: 100pF; Published: 8-Jun-2000; LatestRevisionDate: 05-oct-2007  -  Semtech; LatestRevisionNote: Re-released for DXP Platform.; Publisher: Altium Limited
C34 C40 C41 C46 C47 = Cap: Capacitor SMD; Value: NC; Published: 8-Jun-2000; LatestRevisionDate: 05-oct-2007  -  Semtech; LatestRevisionNote: Re-released for DXP Platform.; Publisher: Altium Limited
C44 = Cap Semi: Capacitor (Semiconductor SIM Model); Published: 8-Jun-2000; LatestRevisionDate: 05-oct-2007  -  Semtech; LatestRevisionNote: Re-released for DXP Platform.; Publisher: Altium Limited
GND RXTX_RFMDOD = test_pin: LatestRevisionDate: 05-oct-2007  -  Semtech
K_SX12xx = SM12xx Header: SM12xx Header; 34pins: 2x10pins + 2x7pins; LatestRevisionDate: 24.8.2012; LatestRevisionNote: Re-released for DXP Platform.; Publisher: Altium Limited; Supplier 1: Mouser; Supplier 2: Mouser
L1-L9 L12 L13 = Inductor: Inductor SMD; Code_IEC: 1005; Value: VAL?; Published: 8-Jun-2000; LatestRevisionDate: 05-oct-2007  -  Semtech; LatestRevisionNote: Re-released for DXP Platform.; Publisher: Altium Limited; Code_JEITA: 0402
L10 L11 L14 = Inductor: Inductor SMD; Code_IEC: 1005; Value: 0R; Published: 8-Jun-2000; LatestRevisionDate: 05-oct-2007  -  Semtech; LatestRevisionNote: Re-released for DXP Platform.; Publisher: Altium Limited; Code_JEITA: 0402
Logo_Bot Logo_Lora_Bot Logo_Lora_Top Logo_Top = Logo: Schematic symbol for Logo
Q1 = Xtal GND: Crystal with GND pins; LatestRevisionDate: 05-oct-2007  -  Semtech
R1-R3 R6-R12 R14 R15 = Resistor: Resistor SMD - IEC symbol version; LatestRevisionDate: 27-Jul-20  -  Semtech
R4 R5 R13 = EXBN8VxxxJX: Mini-Flat Package, Isolated Resistor Network, 0.031 W/resistor
Shield = Shield: Shield - EMI Gasket - Standard Surface Mount Shields
U1 = SX1276: SX1276 - Low Power Integrated UHF Transceiver with loRa Modem; LatestRevisionDate: 27-Jul-2009 -  Semtech
U2 U5 = PE4259 RF Switch: PE4259 Peregrine RF Switch; LatestRevisionDate: 03-Sep-2012 -  Semtech
U3 = 24AA128-I/MF: 128kbit, 400kHz, 1.7V, 8-Pin DFN, Industrial Temperature; Published: 2-Dec-2009; DatasheetVersion: revF, Oct-2008; PackageVersion: revBB, Aug-2009; Publisher: Altium Limited; Supplier 1: Digi-Key; Supplier Part Number 1: 24AA128-I/MF; ComponentLink2Description: Packaging Specification; ComponentLink3Description: Microchip.com Home; ComponentLink3URL: http://www.microchip.com/
U4 U6 = SAW Filter: SAW Filter - Bandpass - TEMEX type; LatestRevisionDate: 05-oct-2007  -  Semtech
VDD_RFS = Jumper: Jumper Wire; LatestRevisionDate: 05-oct-2007  -  Semtech

## Nets that join several sheets
GND: Asfaloth_L2_AVI_ver1.1 (79 pins), U_LoRa_downlink (64 pins), U_LoRa_uplink (64 pins)
VDD_ANA: Asfaloth_L2_AVI_ver1.1 (R18.2 R19.2), U_LoRa_downlink (17 pins), U_LoRa_uplink (17 pins)
VDD_FEM: U_LoRa_downlink (C25_U_LoRa_downlink.1 LoRa_downlink.34), U_LoRa_uplink (C25_U_LoRa_uplink.1 LoRa_uplink.34)
VDD_RFS: U_LoRa_downlink (10 pins), U_LoRa_uplink (10 pins)
DIO0: Asfaloth_L2_AVI_ver1.1 (U1.46), U_LoRa_uplink (LoRa_uplink.12 R4_U_LoRa_uplink.5)
DIO0: Asfaloth_L2_AVI_ver1.1 (U1.140), U_LoRa_downlink (LoRa_downlink.12 R4_U_LoRa_downlink.5)
FEM_CPS: Asfaloth_L2_AVI_ver1.1 (U1.141), U_LoRa_downlink (LoRa_downlink.18 R15_U_LoRa_downlink.2)
FEM_CTX: Asfaloth_L2_AVI_ver1.1 (U1.45), U_LoRa_uplink (LoRa_uplink.20 R2_U_LoRa_uplink.2)
MISO: Asfaloth_L2_AVI_ver1.1 (U1.42), U_LoRa_uplink (LoRa_uplink.8 R13_U_LoRa_uplink.5)
MISO: Asfaloth_L2_AVI_ver1.1 (U1.4), U_LoRa_downlink (LoRa_downlink.8 R13_U_LoRa_downlink.5)
MOSI: Asfaloth_L2_AVI_ver1.1 (U1.43), U_LoRa_uplink (LoRa_uplink.3 R13_U_LoRa_uplink.6)
MOSI: Asfaloth_L2_AVI_ver1.1 (U1.5), U_LoRa_downlink (LoRa_downlink.3 R13_U_LoRa_downlink.6)
NRESET: Asfaloth_L2_AVI_ver1.1 (U1.44), U_LoRa_uplink (LoRa_uplink.10 R14_U_LoRa_uplink.2)
NRESET: Asfaloth_L2_AVI_ver1.1 (U1.142), U_LoRa_downlink (LoRa_downlink.10 R14_U_LoRa_downlink.2)
NSS: Asfaloth_L2_AVI_ver1.1 (U1.40), U_LoRa_uplink (LoRa_uplink.7 R13_U_LoRa_uplink.7)
NSS: Asfaloth_L2_AVI_ver1.1 (U1.3), U_LoRa_downlink (LoRa_downlink.7 R13_U_LoRa_downlink.7)
SCK: Asfaloth_L2_AVI_ver1.1 (U1.41), U_LoRa_uplink (LoRa_uplink.1 R5_U_LoRa_uplink.7)
SCK: Asfaloth_L2_AVI_ver1.1 (U1.1), U_LoRa_downlink (LoRa_downlink.1 R5_U_LoRa_downlink.7)